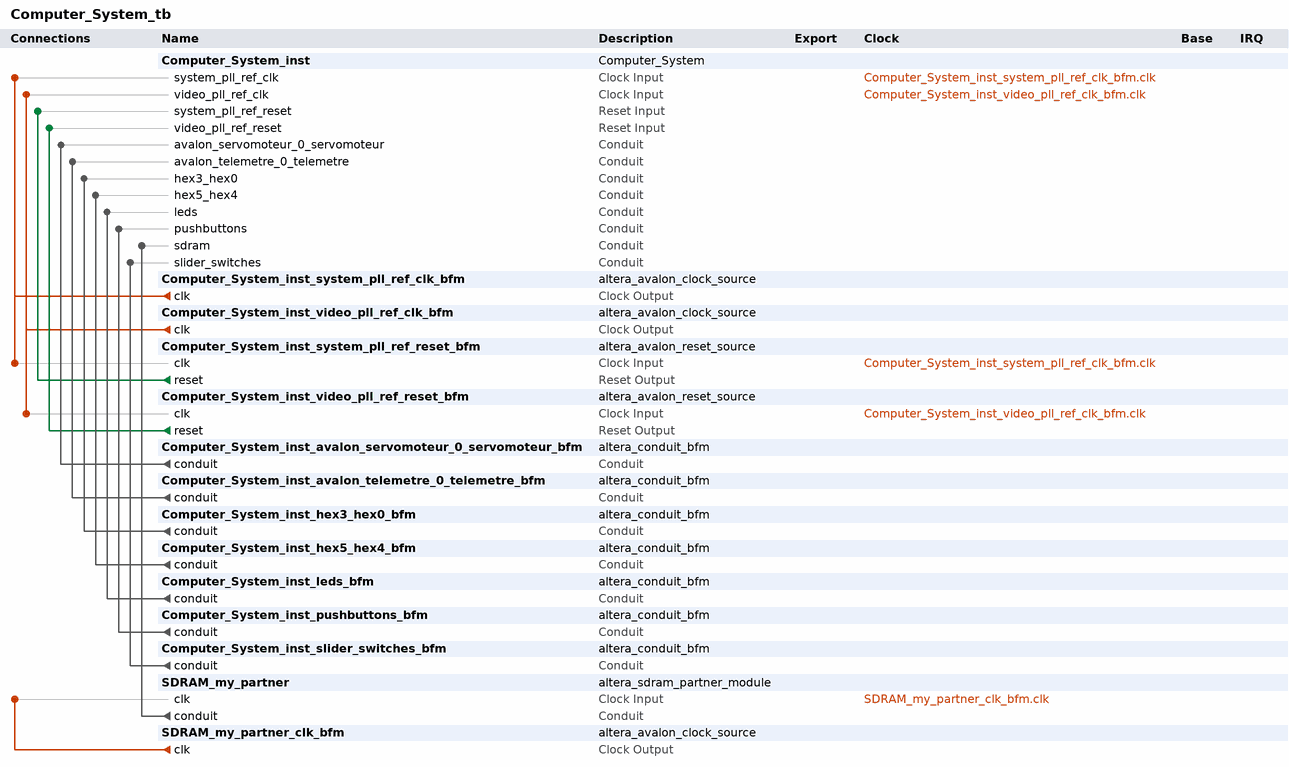
[diagram p0: system contents]
# Platform Designer (Qsys) system Computer_System_tb, MAX 10 10M50DAF484C6GES
# Parameters at their usual value, and those the tool derives, are not listed.
package require -exact qsys 18.1
create_system Computer_System_tb
set_project_property DEVICE_FAMILY {MAX 10}
set_project_property DEVICE 10M50DAF484C6GES

add_instance Computer_System_inst Computer_System 1.0

add_instance Computer_System_inst_system_pll_ref_clk_bfm altera_avalon_clock_source 18.1

add_instance Computer_System_inst_video_pll_ref_clk_bfm altera_avalon_clock_source 18.1

add_instance Computer_System_inst_system_pll_ref_reset_bfm altera_avalon_reset_source 18.1
set_instance_parameter_value Computer_System_inst_system_pll_ref_reset_bfm ASSERT_HIGH_RESET 1
set_instance_parameter_value Computer_System_inst_system_pll_ref_reset_bfm INITIAL_RESET_CYCLES 50

add_instance Computer_System_inst_video_pll_ref_reset_bfm altera_avalon_reset_source 18.1
set_instance_parameter_value Computer_System_inst_video_pll_ref_reset_bfm ASSERT_HIGH_RESET 1
set_instance_parameter_value Computer_System_inst_video_pll_ref_reset_bfm INITIAL_RESET_CYCLES 50

add_instance Computer_System_inst_avalon_servomoteur_0_servomoteur_bfm altera_conduit_bfm 18.1
set_instance_parameter_value Computer_System_inst_avalon_servomoteur_0_servomoteur_bfm CLOCKED_SIGNAL false
set_instance_parameter_value Computer_System_inst_avalon_servomoteur_0_servomoteur_bfm ENABLE_RESET false
set_instance_parameter_value Computer_System_inst_avalon_servomoteur_0_servomoteur_bfm SIGNAL_DIRECTIONS input
set_instance_parameter_value Computer_System_inst_avalon_servomoteur_0_servomoteur_bfm SIGNAL_ROLES commande
set_instance_parameter_value Computer_System_inst_avalon_servomoteur_0_servomoteur_bfm SIGNAL_WIDTHS 1

add_instance Computer_System_inst_avalon_telemetre_0_telemetre_bfm altera_conduit_bfm 18.1
set_instance_parameter_value Computer_System_inst_avalon_telemetre_0_telemetre_bfm CLOCKED_SIGNAL false
set_instance_parameter_value Computer_System_inst_avalon_telemetre_0_telemetre_bfm ENABLE_RESET false
set_instance_parameter_value Computer_System_inst_avalon_telemetre_0_telemetre_bfm SIGNAL_DIRECTIONS input,output,input
set_instance_parameter_value Computer_System_inst_avalon_telemetre_0_telemetre_bfm SIGNAL_ROLES distance,echo,trig
set_instance_parameter_value Computer_System_inst_avalon_telemetre_0_telemetre_bfm SIGNAL_WIDTHS 10,1,1

add_instance Computer_System_inst_hex3_hex0_bfm altera_conduit_bfm 18.1
set_instance_parameter_value Computer_System_inst_hex3_hex0_bfm CLOCKED_SIGNAL false
set_instance_parameter_value Computer_System_inst_hex3_hex0_bfm ENABLE_RESET false
set_instance_parameter_value Computer_System_inst_hex3_hex0_bfm SIGNAL_DIRECTIONS input
set_instance_parameter_value Computer_System_inst_hex3_hex0_bfm SIGNAL_WIDTHS 32

add_instance Computer_System_inst_hex5_hex4_bfm altera_conduit_bfm 18.1
set_instance_parameter_value Computer_System_inst_hex5_hex4_bfm CLOCKED_SIGNAL false
set_instance_parameter_value Computer_System_inst_hex5_hex4_bfm ENABLE_RESET false
set_instance_parameter_value Computer_System_inst_hex5_hex4_bfm SIGNAL_DIRECTIONS input
set_instance_parameter_value Computer_System_inst_hex5_hex4_bfm SIGNAL_WIDTHS 16

add_instance Computer_System_inst_leds_bfm altera_conduit_bfm 18.1
set_instance_parameter_value Computer_System_inst_leds_bfm CLOCKED_SIGNAL false
set_instance_parameter_value Computer_System_inst_leds_bfm ENABLE_RESET false
set_instance_parameter_value Computer_System_inst_leds_bfm SIGNAL_DIRECTIONS input
set_instance_parameter_value Computer_System_inst_leds_bfm SIGNAL_WIDTHS 10

add_instance Computer_System_inst_pushbuttons_bfm altera_conduit_bfm 18.1
set_instance_parameter_value Computer_System_inst_pushbuttons_bfm CLOCKED_SIGNAL false
set_instance_parameter_value Computer_System_inst_pushbuttons_bfm ENABLE_RESET false
set_instance_parameter_value Computer_System_inst_pushbuttons_bfm SIGNAL_DIRECTIONS output
set_instance_parameter_value Computer_System_inst_pushbuttons_bfm SIGNAL_WIDTHS 2

add_instance Computer_System_inst_slider_switches_bfm altera_conduit_bfm 18.1
set_instance_parameter_value Computer_System_inst_slider_switches_bfm CLOCKED_SIGNAL false
set_instance_parameter_value Computer_System_inst_slider_switches_bfm ENABLE_RESET false
set_instance_parameter_value Computer_System_inst_slider_switches_bfm SIGNAL_DIRECTIONS output
set_instance_parameter_value Computer_System_inst_slider_switches_bfm SIGNAL_WIDTHS 10

add_instance SDRAM_my_partner altera_sdram_partner_module 11.0
set_instance_parameter_value SDRAM_my_partner CONTR_NAME Computer_System_SDRAM
set_instance_parameter_value SDRAM_my_partner SDRAM_COL_WIDTH 10
set_instance_parameter_value SDRAM_my_partner SDRAM_DATA_WIDTH 16
set_instance_parameter_value SDRAM_my_partner SDRAM_ROW_WIDTH 13

add_instance SDRAM_my_partner_clk_bfm altera_avalon_clock_source 18.1
set_instance_parameter_value SDRAM_my_partner_clk_bfm CLOCK_RATE 100000000

# connections
add_connection Computer_System_inst_system_pll_ref_clk_bfm.clk Computer_System_inst.system_pll_ref_clk clock
add_connection Computer_System_inst_system_pll_ref_clk_bfm.clk Computer_System_inst_system_pll_ref_reset_bfm.clk clock
add_connection Computer_System_inst_video_pll_ref_clk_bfm.clk Computer_System_inst.video_pll_ref_clk clock
add_connection Computer_System_inst_video_pll_ref_clk_bfm.clk Computer_System_inst_video_pll_ref_reset_bfm.clk clock
add_connection SDRAM_my_partner_clk_bfm.clk SDRAM_my_partner.clk clock
add_connection Computer_System_inst_system_pll_ref_reset_bfm.reset Computer_System_inst.system_pll_ref_reset reset
add_connection Computer_System_inst_video_pll_ref_reset_bfm.reset Computer_System_inst.video_pll_ref_reset reset
add_connection Computer_System_inst_avalon_servomoteur_0_servomoteur_bfm.conduit Computer_System_inst.avalon_servomoteur_0_servomoteur conduit
add_connection Computer_System_inst_avalon_telemetre_0_telemetre_bfm.conduit Computer_System_inst.avalon_telemetre_0_telemetre conduit
add_connection Computer_System_inst_hex3_hex0_bfm.conduit Computer_System_inst.hex3_hex0 conduit
add_connection Computer_System_inst_hex5_hex4_bfm.conduit Computer_System_inst.hex5_hex4 conduit
add_connection Computer_System_inst_leds_bfm.conduit Computer_System_inst.leds conduit
add_connection Computer_System_inst_pushbuttons_bfm.conduit Computer_System_inst.pushbuttons conduit
add_connection Computer_System_inst_slider_switches_bfm.conduit Computer_System_inst.slider_switches conduit
add_connection SDRAM_my_partner.conduit Computer_System_inst.sdram conduit

set_interconnect_requirement {$system} qsys_mm.clockCrossingAdapter HANDSHAKE
set_interconnect_requirement {$system} qsys_mm.enableEccProtection FALSE
set_interconnect_requirement {$system} qsys_mm.insertDefaultSlave FALSE
set_interconnect_requirement {$system} qsys_mm.maxAdditionalLatency 1

save_system Computer_System_tb.qsys
